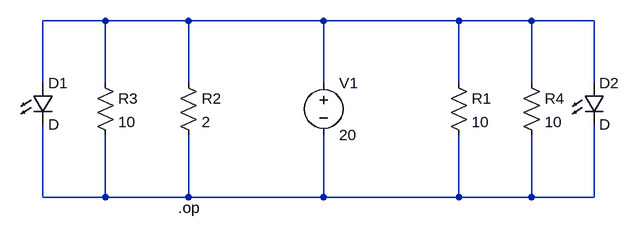
[diagram p0: schematic Circuit.asc]
Circuit.asc, the LTspice schematic file:
Version 4.1
SHEET 1 880 680
WIRE -240 32 -336 32
WIRE -112 32 -240 32
WIRE 96 32 -112 32
WIRE 304 32 96 32
WIRE 416 32 304 32
WIRE 512 32 416 32
WIRE -336 128 -336 32
WIRE -240 128 -240 32
WIRE -112 128 -112 32
WIRE 96 128 96 32
WIRE 304 128 304 32
WIRE 416 128 416 32
WIRE 512 128 512 32
WIRE -336 304 -336 192
WIRE -240 304 -240 208
WIRE -240 304 -336 304
WIRE -112 304 -112 208
WIRE -112 304 -240 304
WIRE 96 304 96 208
WIRE 96 304 -112 304
WIRE 304 304 304 208
WIRE 304 304 96 304
WIRE 416 304 416 208
WIRE 416 304 304 304
WIRE 512 304 512 192
WIRE 512 304 416 304
DATAFLAG -240 32 ""
DATAFLAG -176 32 ""
DATAFLAG 0 32 ""
DATAFLAG 192 32 ""
DATAFLAG 336 32 ""
DATAFLAG 432 32 ""
DATAFLAG -336 224 ""
DATAFLAG -240 240 ""
DATAFLAG -112 240 ""
DATAFLAG 96 256 ""
DATAFLAG 304 256 ""
DATAFLAG 416 256 ""
DATAFLAG 512 256 ""
SYMBOL voltage 96 112 R0
SYMATTR InstName V1
SYMATTR Value 20
SYMBOL res 288 112 R0
SYMATTR InstName R1
SYMATTR Value 10
SYMBOL res -128 112 R0
SYMATTR InstName R2
SYMATTR Value 2
SYMBOL res -256 112 R0
SYMATTR InstName R3
SYMATTR Value 10
SYMBOL res 400 112 R0
SYMATTR InstName R4
SYMATTR Value 10
SYMBOL LED -352 128 R0
SYMATTR InstName D1
SYMBOL LED 496 128 R0
SYMATTR InstName D2
TEXT -128 320 Left 2 !.op

The netlist it stands for:
* Circuit.asc
V1 N001 N002 20
R1 N001 N002 10
R2 N001 N002 2
R3 N001 N002 10
R4 N001 N002 10
D1 N001 N002 D
D2 N001 N002 D
.model D D
.lib standard.dio
.op
.backanno
.end